# EAGLE design HumidityFan (EAGLE 9.1.3)
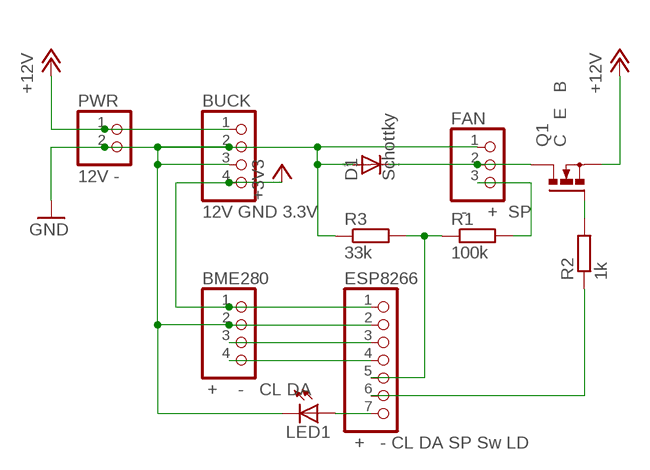
[diagram p0: schematic, sheet 1]

## Parts
BME280  + - CL DA  PINHD-1X4  [1X04]
BUCK  12V GND 3.3V  PINHD-1X4  [1X04]
D1  Schottky  1N4446  [DO35-10]
ESP8266  + - CL DA SP Sw LD  PINHD-1X7  [1X07]
FAN  - + SP  PINHD-1X3  [1X03]
LED1  LED5MM  [LED5MM]
PWR  12V -  PINHD-1X2  [1X02]
Q1  C E B  PMOSFET_NTO220BV  [TO220BV]
R1  100k  R-EU_0204/7  [0204/7]
R2  1k  R-EU_0204/7  [0204/7]
R3  33k  R-EU_0204/7  [0204/7]

## Nets
+3V3: BME280.1 BUCK.4 ESP8266.1
+12V: BUCK.1 PWR.1 Q1.S
GND: BME280.2 BUCK.2 BUCK.3 D1.A ESP8266.2 FAN.1 LED1.K(C) PWR.2 R3.1
N$1: Q1.G R2.2
N$2: D1.C FAN.2 Q1.D
N$7: ESP8266.6 R2.1
N$8: ESP8266.7 LED1.A
SCL: BME280.3 ESP8266.3
SDA: BME280.4 ESP8266.4
SPD3.3V: ESP8266.5 R1.1 R3.2
SPD12V: FAN.3 R1.2

## Library data of the parts
BME280 BUCK = pinhead:PINHD-1X4: PIN HEADER
D1 = diode:1N4446: DIODE high speed (Philips)
ESP8266 = pinhead:PINHD-1X7: PIN HEADER
FAN = pinhead:PINHD-1X3: PIN HEADER
LED1 = led:LED: LED OSRAM: - CHIPLED LG R971, LG N971, LY N971, LG Q971, LY Q971, LO R971, LY R971 LH N974, LH R974 LS Q976, LO Q976, LY Q976 LO Q996 - Hyper CHIPLED LW Q18S LB Q993, LB Q99A, LB R99A - SideLED LS A670, LO A670, LY A670, LG A670, LP A670 LB A673, LV A673, LT A673, LW A673 LH A674 LY A675 LS A676, LA A676, LO A676, LY A676, LW A676 LS A679, LY A679, LG A679 - Hyper Micro SIDELED® LS Y876, LA Y876, LO Y876, LY Y876 LT Y87S - SmartLED LW L88C, LW L88S LB L89C, LB L89S, LG L890 LS L89K, LO L89K, LY L89K LS L896, LA L896, LO L896, LY L896 - TOPLED LS T670, LO T670, LY T670, LG T670, LP T670 LSG T670, LSP T670, LSY T670, LOP T670, LYG T670 LG T671, LOG T671, LSG T671 LB T673, LV T673, LT T673, LW T673 LH T674 LS T676, LA T676, LO T676, LY T676, LB T676, LH T676, LSB T676, LW T676 LB T67C, LV T67C, LT T67C, LS T67K, LO T67K, LY T67K, LW E67C LS E67B, LA E67B, LO E67B, LY E67B, LB E67C, LV E67C, LT E67C LW T67C LS T679, LY T679, LG T679 LS T770, LO T770, LY T770, LG T770, LP T770 LB T773, LV T773, LT T773, LW T773 LH T774 LS E675, LA E675, LY E675, LS T675 LS T776, LA T776, LO T776, LY T776, LB T776 LHGB T686 LT T68C, LB T68C - Hyper Mini TOPLED® LB M676 - Mini TOPLED Santana® LG M470 LS M47K, LO M47K, LY M47K Source: http://www.osram.convergy.de LUXEON: - LUMILED® LXK2-PW12-R00, LXK2-PW12-S00, LXK2-PW14-U00, LXK2-PW14-V00 LXK2-PM12-R00, LXK2-PM12-S00, LXK2-PM14-U00 LXK2-PE12-Q00, LXK2-PE12-R00, LXK2-PE12-S00, LXK2-PE14-T00, LXK2-PE14-U00 LXK2-PB12-K00, LXK2-PB12-L00, LXK2-PB12-M00, LXK2-PB14-N00, LXK2-PB14-P00, LXK2-PB14-Q00 LXK2-PR12-L00, LXK2-PR12-M00, LXK2-PR14-Q00, LXK2-PR14-R00 LXK2-PD12-Q00, LXK2-PD12-R00, LXK2-PD12-S00 LXK2-PH12-R00, LXK2-PH12-S00 LXK2-PL12-P00, LXK2-PL12-Q00, LXK2-PL12-R00 Source: www.luxeon.com KINGBRIGHT: KA-3528ASYC Source: www.kingbright.com
PWR = pinhead:PINHD-1X2: PIN HEADER
Q1 = transistor-power:PMOSFET_N: Power MOSFET N-Channel
R1-R3 = rcl:R-EU_: RESISTOR, European symbol; SPICEPREFIX: R

## Net classes
0 default: width 0.762 mm, drill 0.762 mm, clearance 0.762 mm

## Board
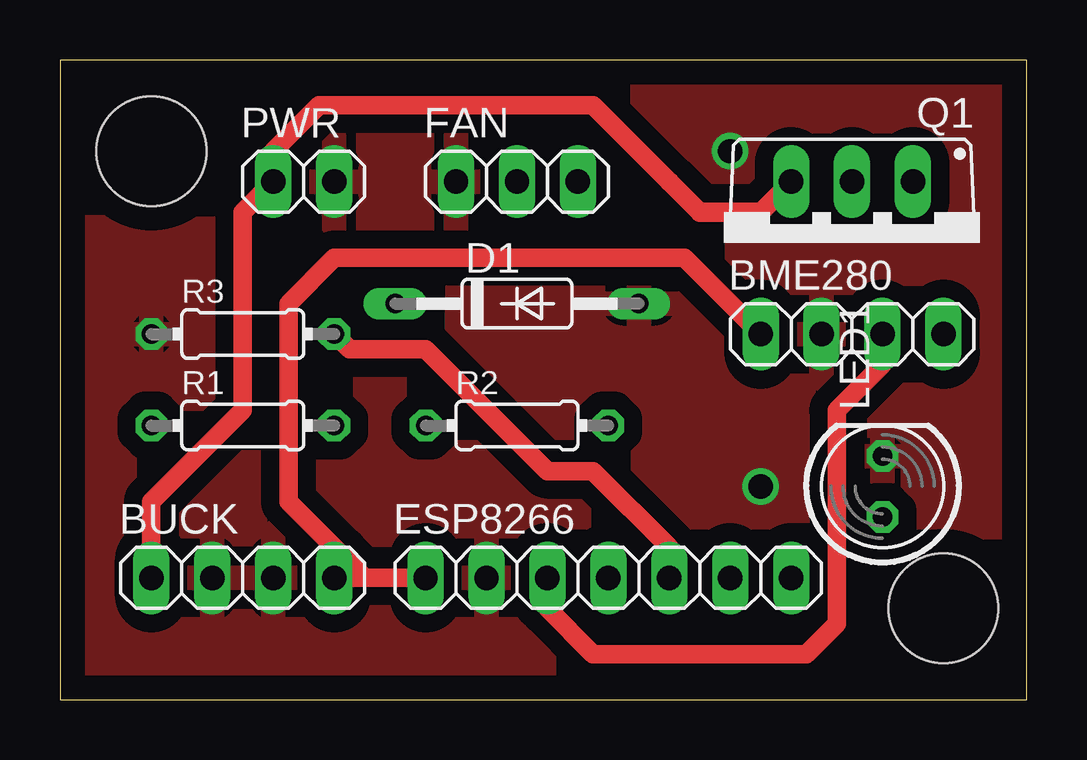
[diagram p1: board, top side]
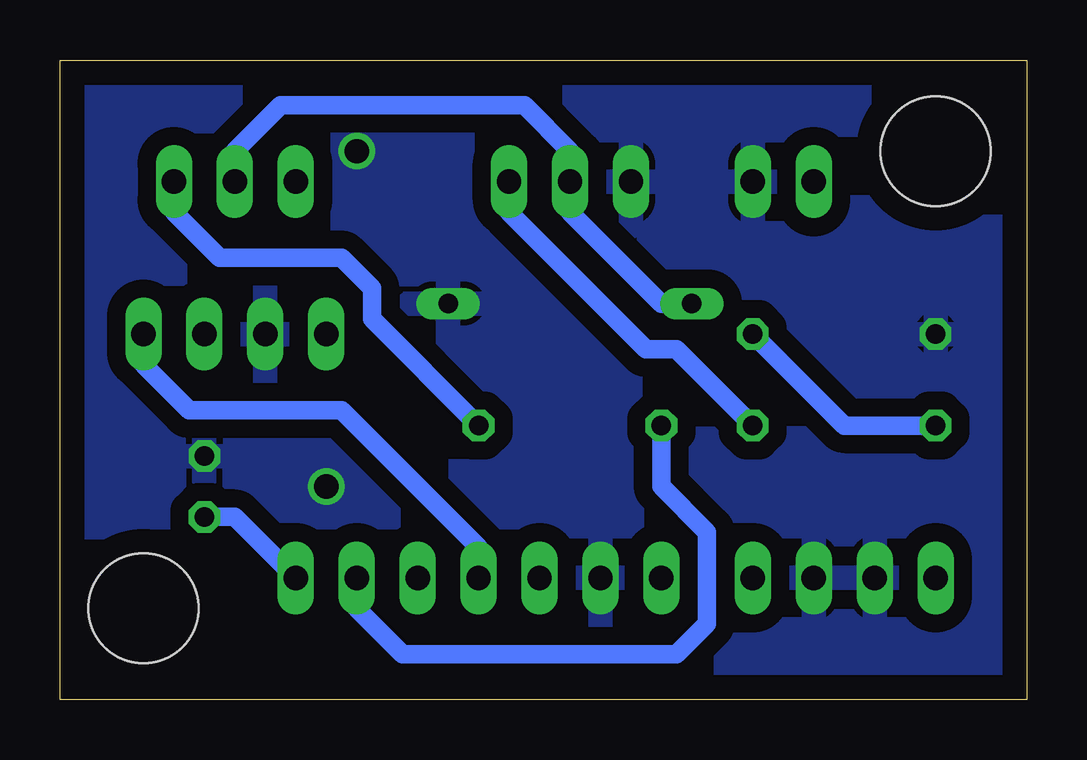
[diagram p2: board, bottom side, seen from below]

Size 40.31 x 26.66 mm. Coordinates in mm from the lower left corner, seen from the top.
Outline: 0,0 40.31,0 40.31,26.66 0,26.66 0,0
Copper layers (1*16): Top 0.035mm / dielectric 1.5mm / Bottom 0.035mm
Design rules "default": minimum track width 6mil, minimum drill 0.35mm, track to track 6mil, track to pad 6mil, pad to pad 6mil, via to via 6mil, smd to smd 6mil, copper to edge 40mil, drill to drill 6mil, minimum pad ring 10mil, minimum via ring 8mil, stop-mask expansion 4mil, vias tented up to drill 0mil, thermal gap 10mil
Holes 4.57 mm at 3.81,22.86 36.83,3.81

### Footprints (pad centres in the part's own frame; a part is rotated, then mirrored left to right if it is on the bottom)
1X04 = drill 1.016 long: 1 -3.81,0; 2 -1.27,0; 3 1.27,0; 4 3.81,0
DO35-10 = drill 0.813 long: A 5.08,0; C -5.08,0
1X07 = drill 1.016 long: 1 -7.62,0; 2 -5.08,0; 3 -2.54,0; 4 0,0; 5 2.54,0; 6 5.08,0; 7 7.62,0
1X03 = drill 1.016 long: 1 -2.54,0; 2 0,0; 3 2.54,0
LED5MM = drill 0.813 octagon: A -1.27,0; K 1.27,0
1X02 = drill 1.016 long: 1 -1.27,0; 2 1.27,0
TO220BV = drill 1.016 long: D 0,-2.54; G -2.54,-2.54; S 2.54,-2.54
0204/7 = drill 0.813 octagon: 1 -3.81,0; 2 3.81,0

### Placement (x,y rotation side)
BME280  33.02,15.24 0 top
BUCK  7.62,5.08 0 top
D1  19.05,16.51 0 top
ESP8266  22.86,5.08 0 top
FAN  19.05,21.59 0 top
LED1  34.29,8.89 90 top
PWR  10.16,21.59 0 top
Q1  33.02,19.05 180 top
R1  7.62,11.43 0 top
R2  19.05,11.43 0 top
R3  7.62,15.24 0 top

### Tracks (layer width: path | path; a pad name or v marks a point on that pad's centre or on a via)
+3V3
  Top 0.762: ESP8266.1 12.7,5.08 | 12.7,5.08 BUCK.4 | BME280.1 26.04,18.41 11.43,18.41 9.53,16.51 9.53,8.25 12.7,5.08
+12V
  Top 0.762: BUCK.1 3.81,8.25 7.62,12.06 7.62,20.32 PWR.1 8.89,22.86 10.79,24.77 22.23,24.77 25.4,21.59
  Top 0.813: Q1.S 29.21,20.32 26.67,20.32 25.4,21.59
GND  (via drill 1.02)
  other vias: 27.94,22.86 29.21,8.89
  pour Top: 0,26.67 40.64,26.67 40.64,0 0,0
  pour Bottom: 0,26.67 40.64,26.67 40.64,0 0,0
N$1
  Bottom 0.762: R2.2 27.3,15.88 27.3,17.14 28.57,18.41 33.65,18.41 35.56,20.32 Q1.G
N$2
  Bottom 0.762: D1.C 15.24,16.51 19.05,20.32 FAN.2 19.05,22.86 20.96,24.77 31.11,24.77 33.02,22.86 Q1.D
N$7
  Bottom 0.762: R2.1 15.24,8.89 13.34,6.98 13.34,3.17 14.61,1.9 26.04,1.9 27.94,3.81 ESP8266.6
N$8
  Bottom 0.762: LED1.A 33.02,7.62 ESP8266.7
SCL
  Top 0.762: ESP8266.3 20.32,3.81 22.23,1.9 31.11,1.9 32.38,3.17 32.38,12.06 34.29,13.97 BME280.3
SDA
  Bottom 0.762: ESP8266.4 22.86,6.35 28.57,12.06 34.92,12.06 36.83,13.97 BME280.4
SPD3.3V
  Top 0.762: ESP8266.5 25.4,6.35 22.23,9.52 20.32,9.52 15.24,14.6 12.07,14.6 R3.2
  Bottom 0.762: R1.1 7.62,11.43 R3.2
SPD12V
  Bottom 0.762: R1.2 14.61,14.6 15.88,14.6 21.59,20.32 FAN.3

### Text on the board
bValues: HumidityFan Rev A 9/2018 Joachim Banzhaf